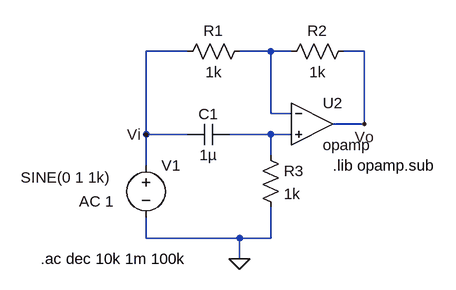
[diagram p0: schematic circuito.asc]
circuito.asc, the LTspice schematic file:
Version 4
SHEET 1 880 680
WIRE 0 -80 -64 -80
WIRE 128 -80 80 -80
WIRE 160 -80 128 -80
WIRE 272 -80 240 -80
WIRE 128 16 128 -80
WIRE 160 16 128 16
WIRE 272 32 272 -80
WIRE 272 32 224 32
WIRE -64 48 -64 -80
WIRE 0 48 -64 48
WIRE 128 48 64 48
WIRE 160 48 128 48
WIRE 128 80 128 48
WIRE -64 96 -64 48
WIRE -64 208 -64 176
WIRE 80 208 -64 208
WIRE 128 208 128 160
WIRE 128 208 80 208
WIRE 80 240 80 208
FLAG 80 240 0
FLAG -64 48 Vi
FLAG 272 32 Vo
SYMBOL res 96 -96 R90
WINDOW 0 0 56 VBottom 2
WINDOW 3 32 56 VTop 2
SYMATTR InstName R1
SYMATTR Value 1k
SYMBOL res 256 -96 R90
WINDOW 0 0 56 VBottom 2
WINDOW 3 32 56 VTop 2
SYMATTR InstName R2
SYMATTR Value 1k
SYMBOL cap 64 32 R90
WINDOW 0 0 32 VBottom 2
WINDOW 3 32 32 VTop 2
SYMATTR InstName C1
SYMATTR Value 1µ
SYMBOL res 112 64 R0
SYMATTR InstName R3
SYMATTR Value 1k
SYMBOL voltage -64 80 R0
WINDOW 3 -193 34 Left 2
WINDOW 123 -103 71 Left 2
WINDOW 39 0 0 Left 0
SYMATTR InstName V1
SYMATTR Value SINE(0 1 1k)
SYMATTR Value2 AC 1
SYMBOL OpAmps\\opamp 192 -32 R0
SYMATTR InstName U2
TEXT -226 240 Left 2 !.ac dec 10k 1m 100k
TEXT 224 96 Left 2 !.lib opamp.sub

The netlist it stands for:
* circuito.asc
R1 N001 Vi 1k
R2 Vo N001 1k
C1 N002 Vi 1µ
R3 N002 0 1k
V1 Vi 0 SINE(0 1 1k) AC 1
XU2 N001 N002 Vo opamp Aol=100K GBW=10Meg  ; pins invin noninvin out
.ac dec 10k 1m 100k
.lib opamp.sub
.backanno
.end